# Altium project USB2CAN.PrjPcb
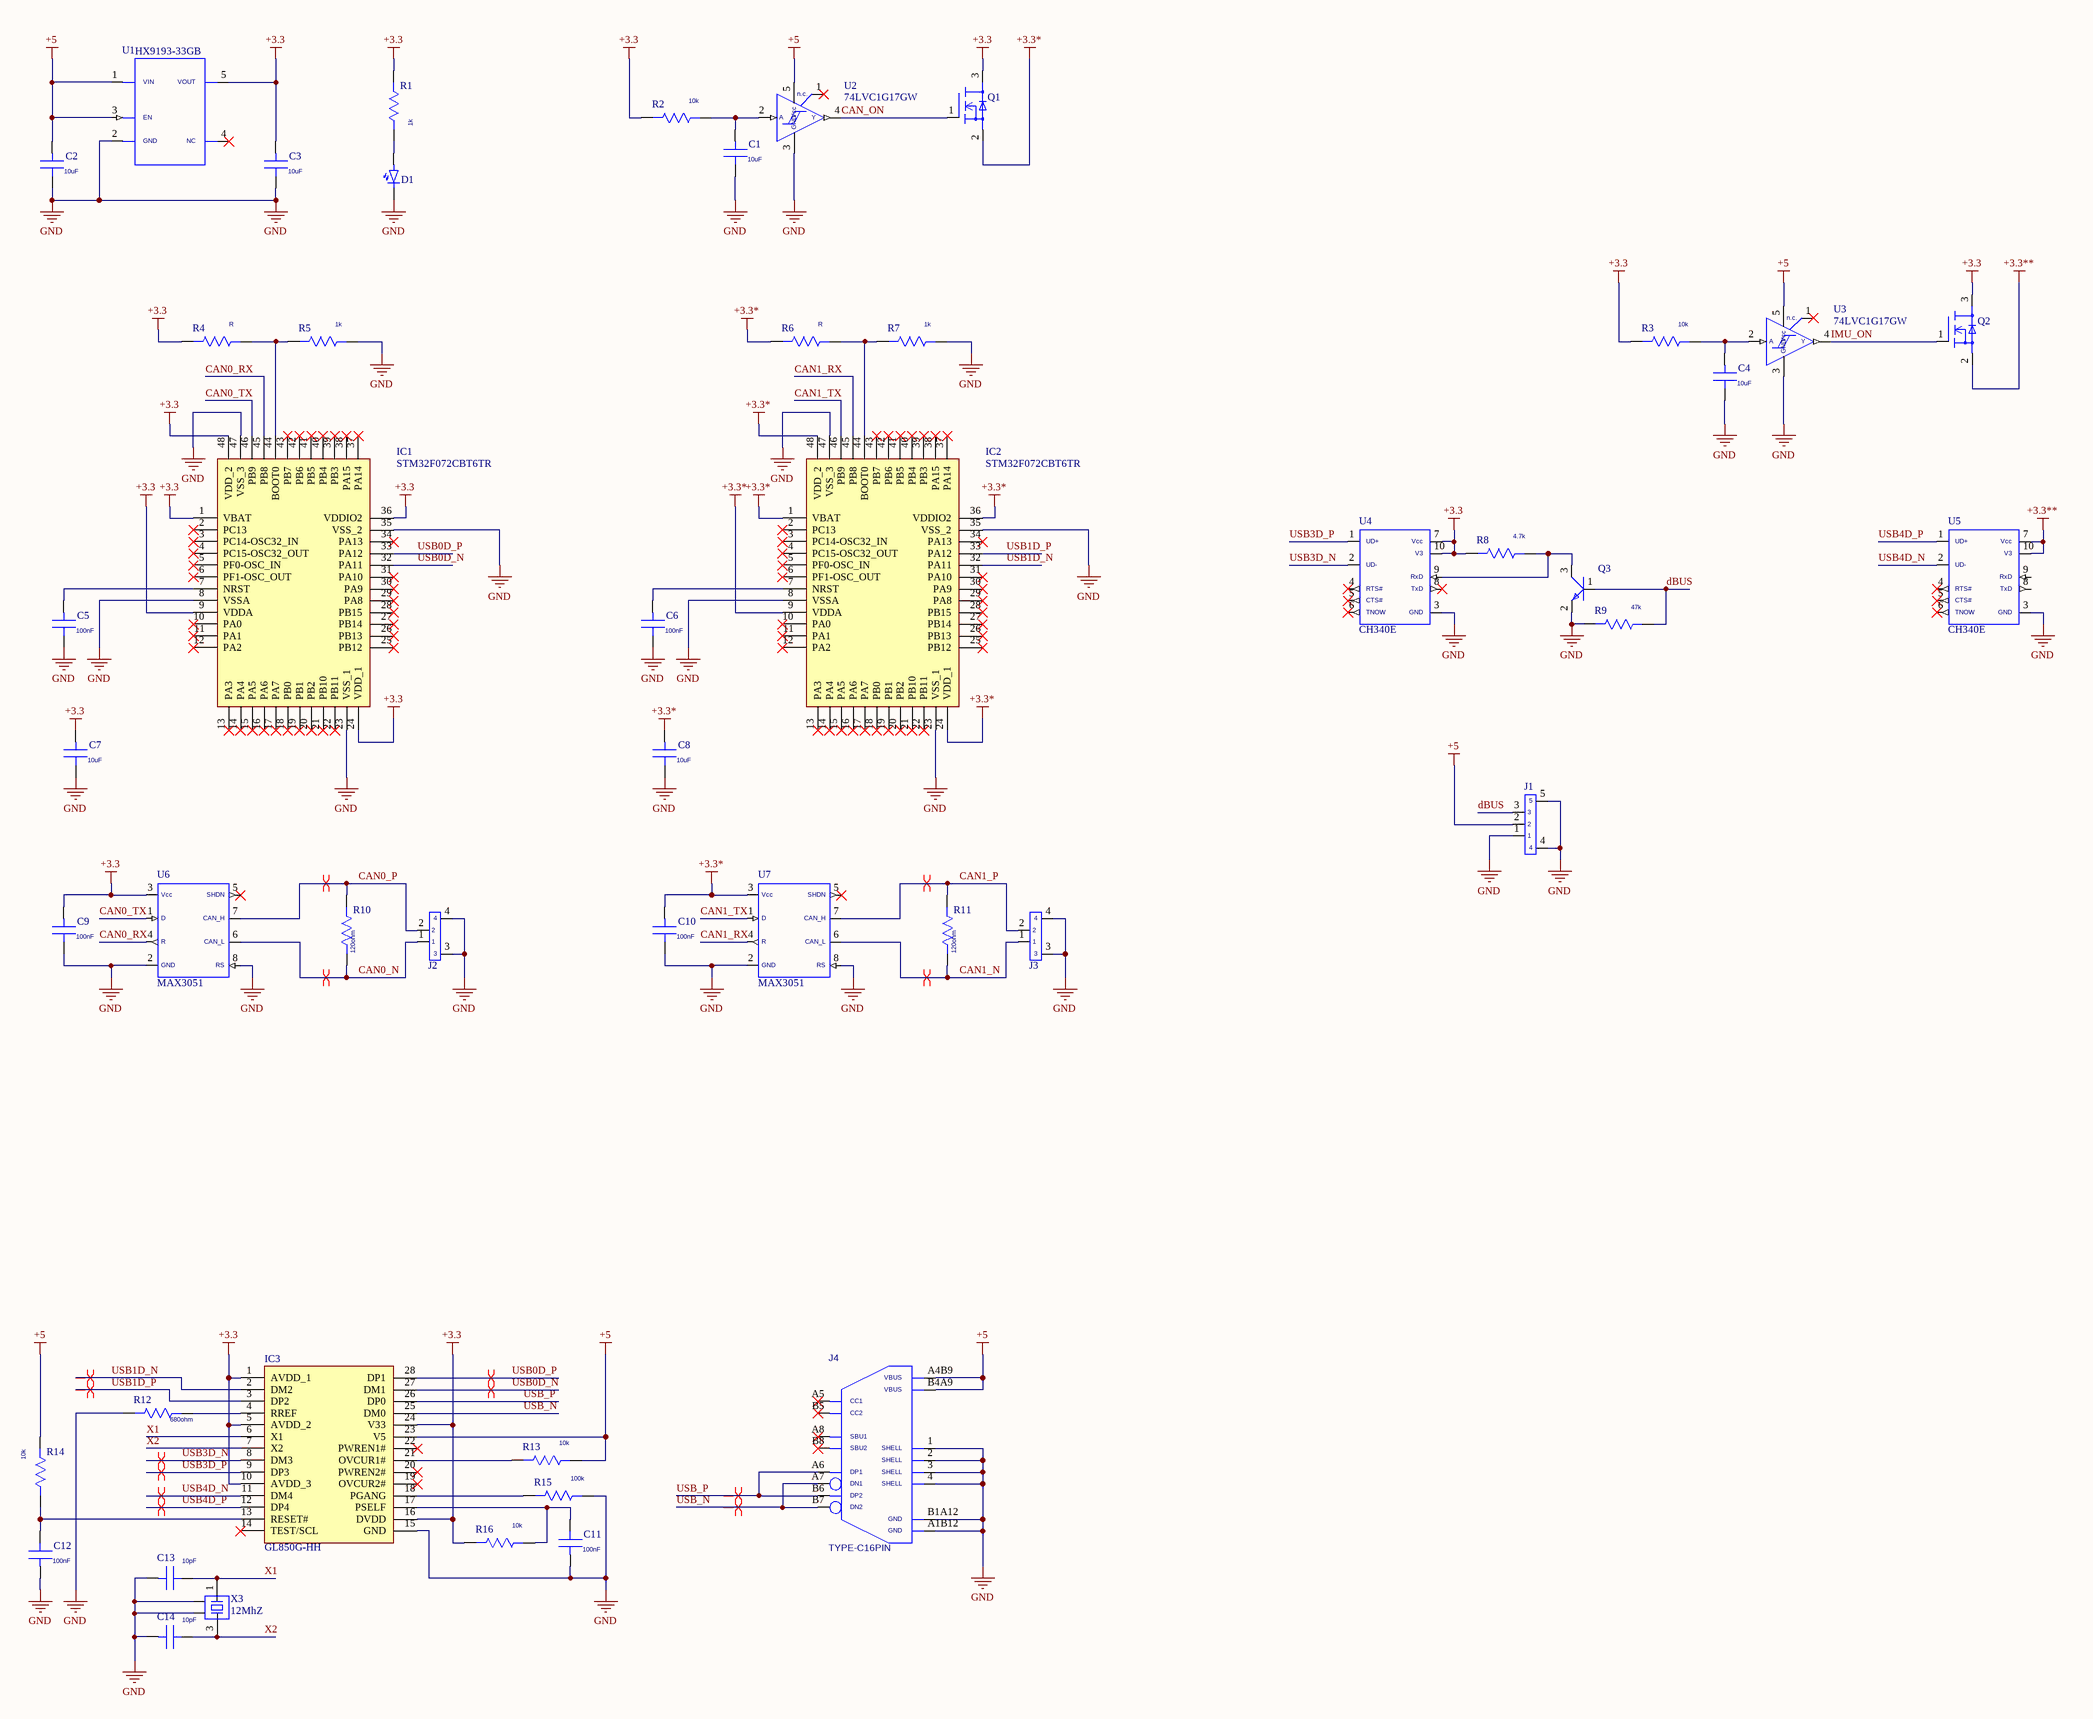
[diagram p0: USB2CAN.SchDoc]
1 sheet, 49 parts. Net scope: global (net labels, ports and power ports of the same name join across sheets).
Board file: USB2CAN.PcbDoc

## Sheet USB2CAN.SchDoc
size A2

### Parts
C1  10uF  [0603C(M1608C)]
C2  10uF  [0603C(M1608C)]
C3  10uF  [0603C(M1608C)]
C4  10uF  [0603C(M1608C)]
C5  100nF  [0402C(M1005C)]
C6  100nF  [0402C(M1005C)]
C7  10uF  [0603C(M1608C)]
C8  10uF  [0603C(M1608C)]
C9  100nF  [0402C(M1005C)]
C10  100nF  [0402C(M1005C)]
C11  100nF  [0402C(M1005C)]
C12  100nF  [0402C(M1005C)]
C13  10pF  [0402C(M1005C)]
C14  10pF  [0402C(M1005C)]
D1  LED  [LED0603]  (value not drawn)
IC1  STM32F072CBT6TR  [QFP50P900X900X160-48N]
IC2  STM32F072CBT6TR  [QFP50P900X900X160-48N]
IC3  GL850G-HH  [SOP65P780X200-28N]
J1  X1251WRS-03HF-LPSW  [GH1.25-3P]  (value not drawn)
J2  X1251WRS-02HF-LPSW  [GH1.25-2P]  (value not drawn)
J3  X1251WRS-02HF-LPSW  [GH1.25-2P]  (value not drawn)
J4  TYPE-C16PIN  [Type-C 16P]
Q1  Q_FET_N  [SOT23]  (value not drawn)
Q2  Q_FET_N  [SOT23]  (value not drawn)
Q3  Q_NPN  [SOT23]  (value not drawn)
R1  1k  [0402R]
R2  10k  [0402R]
R3  10k  [0402R]
R4  R  [0402R]
R5  1k  [0402R]
R6  R  [0402R]
R7  1k  [0402R]
R8  4.7k  [0402R]
R9  47k  [0402R]
R10  120ohm  [0402R]
R11  120ohm  [0402R]
R12  680ohm  [0402R]
R13  10k  [0402R]
R14  10k  [0402R]
R15  100k  [0402R]
R16  10k  [0402R]
U1  HX9193-33GB  [SOT23_5]
U2  74LVC1G17GW  [SOT353]
U3  74LVC1G17GW  [SOT353]
U4  CH340E  [VSSOP10]
U5  CH340E  [VSSOP10]
U6  MAX3051  [SOT23_8]
U7  MAX3051  [SOT23_8]
X3  12MhZ  [OSC 3225-4P]

### Nets
+3.3: C3.1 C7.1 C9.1 IC1.1(VBAT) IC1.9(VDDA) IC1.24(VDD_1) IC1.36(VDDIO2) IC1.48(VDD_2) IC3.1(AVDD_1) IC3.5(AVDD_2) IC3.10(AVDD_3) IC3.16(DVDD) IC3.24(V33) Q1.3(D) Q2.3(D) R1.1 R2.1 R3.1 R4.1 R8.1 R16.1 U1.5(VOUT) U4.7(Vcc) U4.10(V3) U6.3(Vcc)
+3.3*: C8.1 C10.1 IC2.1(VBAT) IC2.9(VDDA) IC2.24(VDD_1) IC2.36(VDDIO2) IC2.48(VDD_2) Q1.2(S) R6.1 U7.3(Vcc)
+3.3**: Q2.2(S) U5.7(Vcc) U5.10(V3)
+5: C2.1 IC3.23(V5) J1.2 J4.A4B9(VBUS) J4.B4A9(VBUS) R13.2 R14.1 U1.1(VIN) U1.3(EN) U2.5(Vcc) U3.5(Vcc)
GND: C1.2 C2.2 C3.2 C4.2 C5.2 C6.2 C7.2 C8.2 C9.2 C10.2 C11.1 C12.1 C13.1 C14.1 D1.2 IC1.8(VSSA) IC1.23(VSS_1) IC1.35(VSS_2) IC1.47(VSS_3) IC2.8(VSSA) IC2.23(VSS_1) IC2.35(VSS_2) IC2.47(VSS_3) IC3.15(GND) J1.1 J1.4 J1.5 J2.3 J2.4 J3.3 J3.4 J4.1(SHELL) J4.2(SHELL) J4.3(SHELL) J4.4(SHELL) J4.A1B12(GND) J4.B1A12(GND) Q3.2(E) R5.2 R7.2 R9.1 R12.1 R15.2 U1.2(GND) U2.3(GND) U3.3(GND) U4.3(GND) U5.3(GND) U6.2(GND) U6.8(RS) U7.2(GND) U7.8(RS) X3.2 X3.4
CAN0_N: J2.1 R10.2 U6.6(CAN_L)
CAN0_P: J2.2 R10.1 U6.7(CAN_H)
CAN0_RX: IC1.45(PB8) U6.4(R)
CAN0_TX: IC1.46(PB9) U6.1(D)
CAN1_N: J3.1 R11.2 U7.6(CAN_L)
CAN1_P: J3.2 R11.1 U7.7(CAN_H)
CAN1_RX: IC2.45(PB8) U7.4(R)
CAN1_TX: IC2.46(PB9) U7.1(D)
CAN_ON: Q1.1(G) U2.4(Y)
dBUS: J1.3 Q3.1(B) R9.2
IMU_ON: Q2.1(G) U3.4(Y)
USB0D_N: IC1.32(PA11) IC3.27(DM1)
USB0D_P: IC1.33(PA12) IC3.28(DP1)
USB1D_N: IC2.32(PA11) IC3.2(DM2)
USB1D_P: IC2.33(PA12) IC3.3(DP2)
USB3D_N: IC3.8(DM3) U4.2(UD-)
USB3D_P: IC3.9(DP3) U4.1(UD+)
USB4D_N: IC3.11(DM4) U5.2(UD-)
USB4D_P: IC3.12(DP4) U5.1(UD+)
USB_N: IC3.25(DM0) J4.A7(DN1) J4.B7(DN2)
USB_P: IC3.26(DP0) J4.A6(DP1) J4.B6(DP2)
X1: C13.2 IC3.6(X1) X3.1
X2: C14.2 IC3.7(X2) X3.3
NetC1_1: C1.1 R2.2 U2.2(A)
NetC4_1: C4.1 R3.2 U3.2(A)
NetC5_1: C5.1 IC1.7(NRST)
NetC6_1: C6.1 IC2.7(NRST)
NetC11_2: C11.2 IC3.17(PSELF) R16.2
NetC12_2: C12.2 IC3.13(RESET#) R14.2
NetD1_1: D1.1 R1.2
NetIC1_44: IC1.44(BOOT0) R4.2 R5.1
NetIC2_44: IC2.44(BOOT0) R6.2 R7.1
NetIC3_4: IC3.4(RREF) R12.2
NetIC3_18: IC3.18(PGANG) R15.1
NetIC3_21: IC3.21(OVCUR1#) R13.1
NetQ3_3: Q3.3(C) R8.2 U4.9(RxD)

Not connected (* = marked no-connect by the designer): IC1 2(PC13)* 3(PC14-OSC32_IN)* 4(PC15-OSC32_OUT)* 5(PF0-OSC_IN)* 6(PF1-OSC_OUT)* 10(PA0)* 11(PA1)* 12(PA2)* 13(PA3)* 14(PA4)* 15(PA5)* 16(PA6)* 17(PA7)* 18(PB0)* 19(PB1)* 20(PB2)* 21(PB10)* 22(PB11)* 25(PB12)* 26(PB13)* 27(PB14)* 28(PB15)* 29(PA8)* 30(PA9)* 31(PA10)* 34(PA13)* 37(PA14)* 38(PA15)* 39(PB3)* 40(PB4)* 41(PB5)* 42(PB6)* 43(PB7)*; IC2 2(PC13)* 3(PC14-OSC32_IN)* 4(PC15-OSC32_OUT)* 5(PF0-OSC_IN)* 6(PF1-OSC_OUT)* 10(PA0)* 11(PA1)* 12(PA2)* 13(PA3)* 14(PA4)* 15(PA5)* 16(PA6)* 17(PA7)* 18(PB0)* 19(PB1)* 20(PB2)* 21(PB10)* 22(PB11)* 25(PB12)* 26(PB13)* 27(PB14)* 28(PB15)* 29(PA8)* 30(PA9)* 31(PA10)* 34(PA13)* 37(PA14)* 38(PA15)* 39(PB3)* 40(PB4)* 41(PB5)* 42(PB6)* 43(PB7)*; IC3 14(TEST/SCL)* 19(OVCUR2#)* 20(PWREN2#)* 22(PWREN1#)*; J4 A5(CC1)* A8(SBU1)* B5(CC2)* B8(SBU2)*; U1 4(NC)*; U2 1(n.c.)*; U3 1(n.c.)*; U4 4(RTS#)* 5(CTS#)* 6(TNOW)* 8(TxD)*; U5 4(RTS#)* 5(CTS#)* 6(TNOW)* 8(TxD) 9(RxD); U6 5(SHDN)*; U7 5(SHDN)*

### Layout directives
differential pair: CAN0_N, CAN0_P, CAN1_N, CAN1_P, USB0D_N, USB0D_P, USB1D_N, USB1D_P, USB3D_N, USB3D_P, USB4D_N, USB4D_P, USB_N, USB_P

### Notes on the sheet
- Title
- Size:
- Date:
- File:
- A2
- Number:
- Time:
- Revision:
- Sheet
- of

### Library data of the parts
C1-C14 = C: IMPLEMENTATION_TYPE: Pspice Model; PSPICETEMPLATE: X^@REFDES  %1    %2   @NV_PN; OriginalSymbolOrigin: (-50,50)
IC1 IC2 = STM32F072CBT6TR: Integrated Circuit; Manufacturer_Name: STMicroelectronics; Datasheet Link: https://www.mouser.com/datasheet/2/389/stm32f072c8-956183.pdf; Height: 1.6mm; Manufacturer_Part_Number: STM32F072CBT6TR; Mouser Part Number: 511-STM32F072CBT6TR; Mouser Price/Stock: https://www.mouser.com/Search/Refine.aspx?Keyword=511-STM32F072CBT6TR; RS Part Number: 1923612; RS Price/Stock: http://uk.rs-online.com/web/p/products/1923612
IC3 = GL850G-HH: Integrated Circuit; Manufacturer_Name: Genesys; Datasheet Link: https://www.kean.com.au/oshw/WR703N/GL850G%20USB%20Hub%201.07.pdf; Height: 2mm; Manufacturer_Part_Number: GL850G-HH; Arrow Part Number: GL850G-HH
J1 = CON_GH1.25_3P: ComponentLink1Description: Materials' link; ComponentLink1URL: https://item.szlcsc.com/363978.html
J2 J3 = CON_GH1.25_2P: ComponentLink1Description: Materials' link; ComponentLink1URL: https://item.szlcsc.com/363977.html
J4 = CON_USB3#1: BOM_Manufacturer: SHOU HAN; Contributor: LCSC; BOM_Supplier: LCSC; BOM_Supplier Part: C393939; BOM_Manufacturer Part: TYPE-C16PIN; spicePre: U; spiceSymbolName: TYPE-C16PIN; ComponentLink1Description: Materials' link; ComponentLink1URL: https://item.szlcsc.com/372551.html
Q3 = Q_NPN: IMPLEMENTATION_TYPE: Pspice Model; PSPICETEMPLATE: X^@REFDES %C %B %E @NV_PN; OriginalSymbolOrigin: (-50,150)
R1-R16 = R: IMPLEMENTATION_TYPE: Pspice Model; PSPICETEMPLATE: X^@REFDES  %1    %2   @NV_PN; OriginalSymbolOrigin: (-50,100)
U1 = U_LDO: ComponentLink1Description: Materials' link; ComponentLink1URL: https://item.szlcsc.com/241915.html
U2 U3 = U_Schmitt: ComponentLink1Description: Materials' link; ComponentLink1URL: https://item.szlcsc.com/125568.html
U4 U5 = U_UART_TRANS
U6 U7 = U_CAN_TRANS#1: ComponentLink1Description: Materials' link; ComponentLink1URL: https://item.szlcsc.com/113237.html
X3 = XTAL_4P: 4脚无源晶振